# EAGLE design Wiper Control v3 (EAGLE 9.6.1)
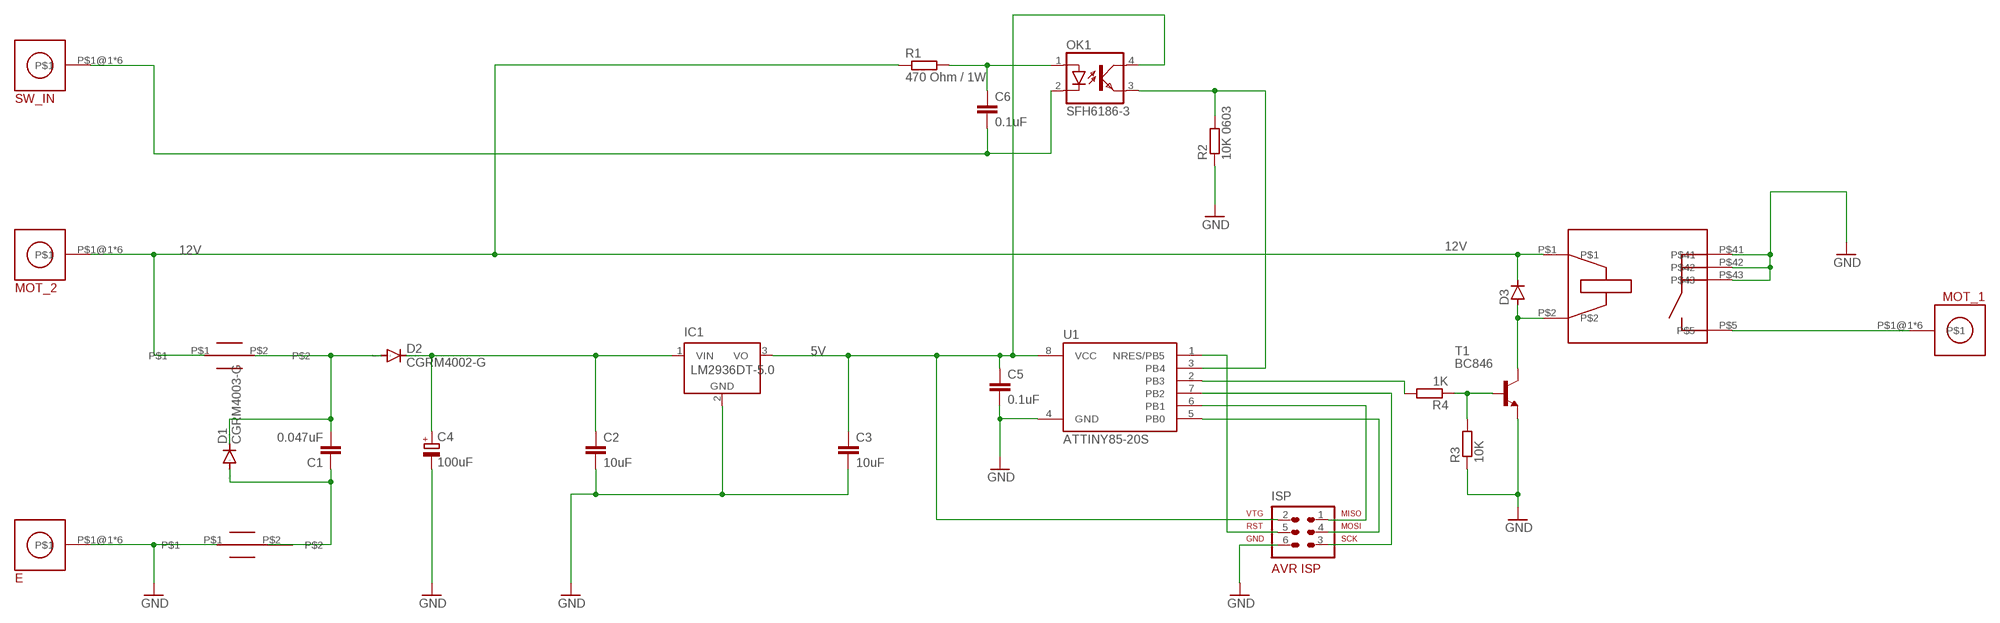
[diagram p0: schematic, sheet 1]

## Parts
B1  FBMJ2125  [FBMJ]
B2  FBMJ2125  [FBMJ]
C1  0.047uF  C-EUC0603  [C0603]
C2  10uF  C-EUC0805  [C0805]
C3  10uF  C-EUC0805  [C0805]
C4  100uF  CPOL-EUE2.5-7  [E2,5-7]
C5  0.1uF  C-EUC0603  [C0603]
C6  0.1uF  C-EUC0603  [C0603]
D1  CGRM4003-G  [SOD-123_MINI-SMA]
D2  CGRM4002-G  [SOD-123_MINI-SMA]
D3  D-SOD123  [SOD123]
E  M4_SCREW_TERMINAL  [M4_SCREW_TERMINAL]
IC1  LM2936DT-5.0  [TO252]
ISP  AVR-ISP-6  [AVR-ISP-6]
MOT_1  M4_SCREW_TERMINAL  [M4_SCREW_TERMINAL]
MOT_2  M4_SCREW_TERMINAL  [M4_SCREW_TERMINAL]
OK1  SFH6186-3  [SMD4-7]
R1  470 Ohm / 1W  R-EU_R2512  [R2512]
R2  10K 0603  R-EU_R0603  [R0603]
R3  10K  R-EU_R0603  [R0603]
R4  1K  R-EU_R0603  [R0603]
SW_IN  M4_SCREW_TERMINAL  [M4_SCREW_TERMINAL]
T1  BC846  [SOT23]
U1  ATTINY85-20S  [SOIC8_EIAJ_208MIL]
U$3  RELAY  [RELAY]

## Nets
5V: C3.1 C5.1 IC1.3(VO) ISP.2 OK1.4(COL) U1.8(VCC)
12V: B1.P$1 D3.1(C) MOT_2.P$1@1 MOT_2.P$1@2 MOT_2.P$1@3 MOT_2.P$1@4 MOT_2.P$1@5 MOT_2.P$1@6 R1.1 U$3.P$1
GND: B2.P$1 C2.2 C3.2 C4.- C5.2 E.P$1@1 E.P$1@2 E.P$1@3 E.P$1@4 E.P$1@5 E.P$1@6 IC1.2(GND) ISP.6 R2.1 R3.1 T1.2(E) U1.4(GND) U$3.P$41 U$3.P$42 U$3.P$43
N$1: B1.P$2 C1.2 D1.C D2.A
N$2: B2.P$2 C1.1 D1.A
N$3: C2.1 C4.+ D2.C IC1.1(VIN)
N$4: ISP.1 U1.6(PB1)
N$5: ISP.4 U1.5(PB0)
N$6: ISP.3 U1.7(PB2)
N$7: ISP.5 U1.1(NRES/PB5)
N$8: D3.2(A) T1.3(C) U$3.P$2
N$9: R3.2 R4.1 T1.1(B)
N$10: MOT_1.P$1@1 MOT_1.P$1@2 MOT_1.P$1@3 MOT_1.P$1@4 MOT_1.P$1@5 MOT_1.P$1@6 U$3.P$5
N$11: C6.1 OK1.1(A) R1.2
N$13: OK1.3(EMIT) R2.2 U1.3(PB4)
N$14: R4.2 U1.2(PB3)
N$20: C6.2 OK1.2(C) SW_IN.P$1@1 SW_IN.P$1@2 SW_IN.P$1@3 SW_IN.P$1@4 SW_IN.P$1@5 SW_IN.P$1@6

## Library data of the parts
B1 B2 = Automotive 12V5V Converter:FBMJ2125
C1-C3 C5 C6 = rcl:C-EU: CAPACITOR, European symbol; SPICEPREFIX: C
C4 = rcl:CPOL-EU: POLARIZED CAPACITOR, European symbol; SPICEPREFIX: C
D1 D2 = diode:CGRM400*-G: Molded plasitc,JEDEC SOD-123/Mini SMA Source: Comchip CGRM4001-G.pdf
D3 = semicon-smd-ipc:D-: DIODE unfilled
E MOT_1 MOT_2 SW_IN = Automotive 12V5V Converter:M4_SCREW_TERMINAL
IC1 = national-semiconductor:LM2936?*: Ultra-Low Quiescent Current LDO Voltage Regulator Source: Data sheet <http://www.national.com/ds/LM/LM2936.pdf>; MF: NATIONAL SEMICONDUCTOR; MPN: LM2936DT-5.0/NOPB; OC_FARNELL: 1286864; OC_NEWARK: 41K4501
ISP = atmel:AVR-ISP-6: AVR ISP-6 Serial Programming Header
OK1 = optocoupler:SFH618?*: Optocoupler, Phototransistor Output, Low Input Current Source: Data sheet <http://www.vishay.com/docs/83673/sfh618.pdf>; MF: VISHAY/TELEFUNKEN; MPN: SFH6186-3; OC_FARNELL: 1469529; OC_NEWARK: 21H7751
R1-R4 = rcl:R-EU_: RESISTOR, European symbol; SPICEPREFIX: R
T1 = transistor-neu-to92:BC846: NPN TRANSISTOR
U1 = _hhn_attiny25_45_85:ATTINY85*: ATMEL ATtiny 85 Packages: P = PDIP 08 30mil S = SOIC 08 EIAJ 208mil Technologies Note: for complete ordering code (temp. range, finish, tape&reel etc.) see www.atmel.com • Supply Voltage: V = (1.8…5.5)V | [blank] = (2.7…5.5)V • Speed: 10 = 10 MHz | 20 = 20 MHz Author: Dipl.-Ing. FH Rainer Bayer HHN Hochschule Heilbronn (Heilbronn University), rainer.bayer@hs-heilbronn.de Ingenieurbüro ing-rb, mail@ing-rb.de
U$3 = Automotive 12V5V Converter:RELAY

## Board
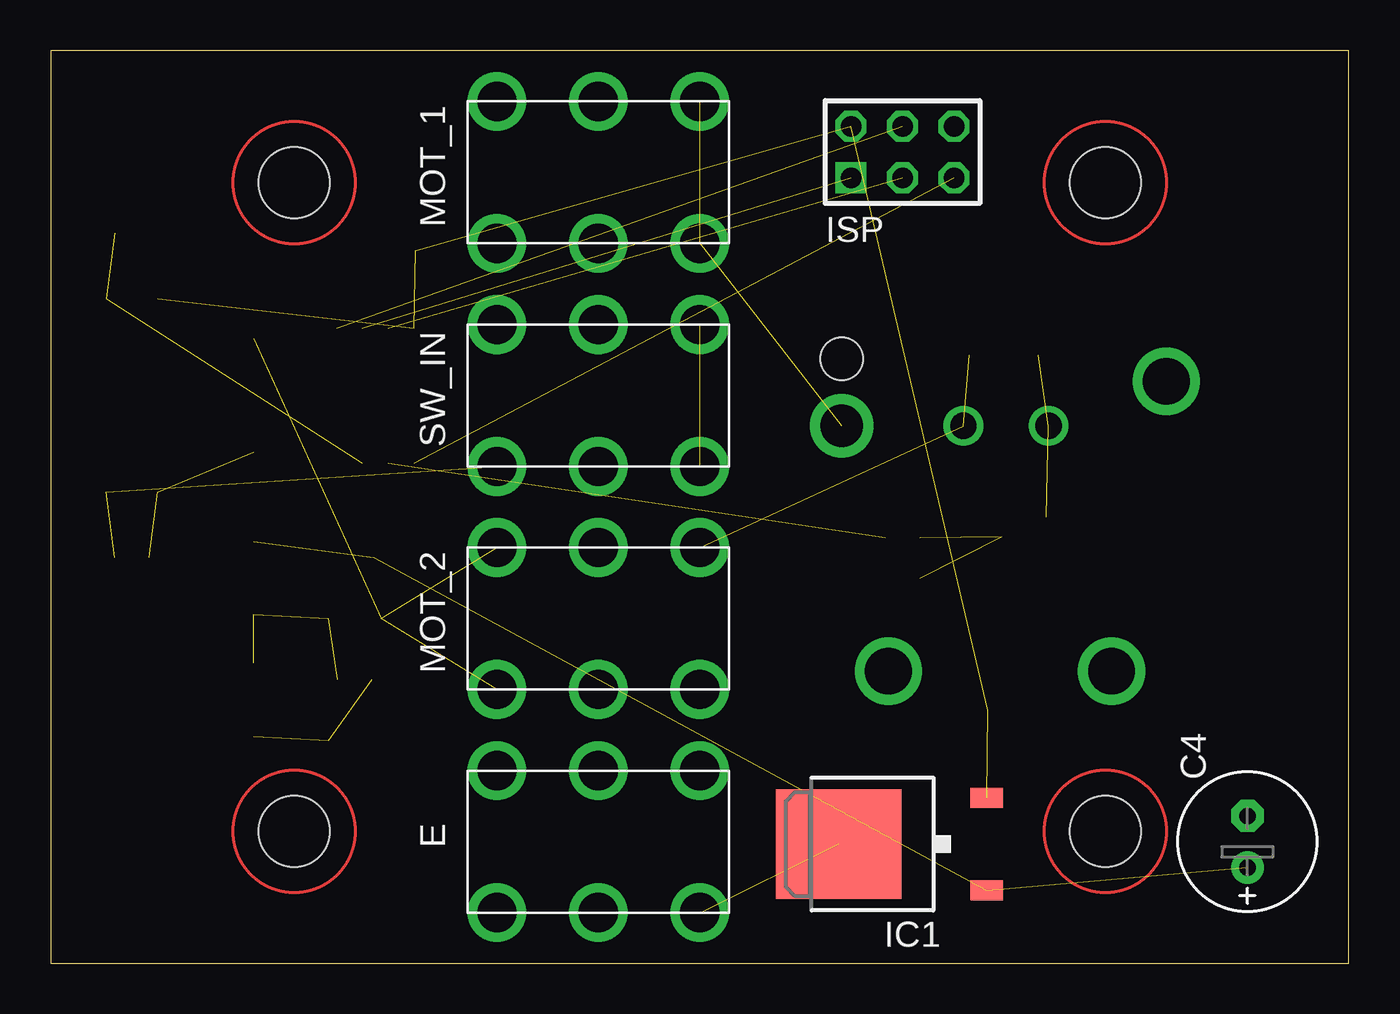
[diagram p1: board, top side]
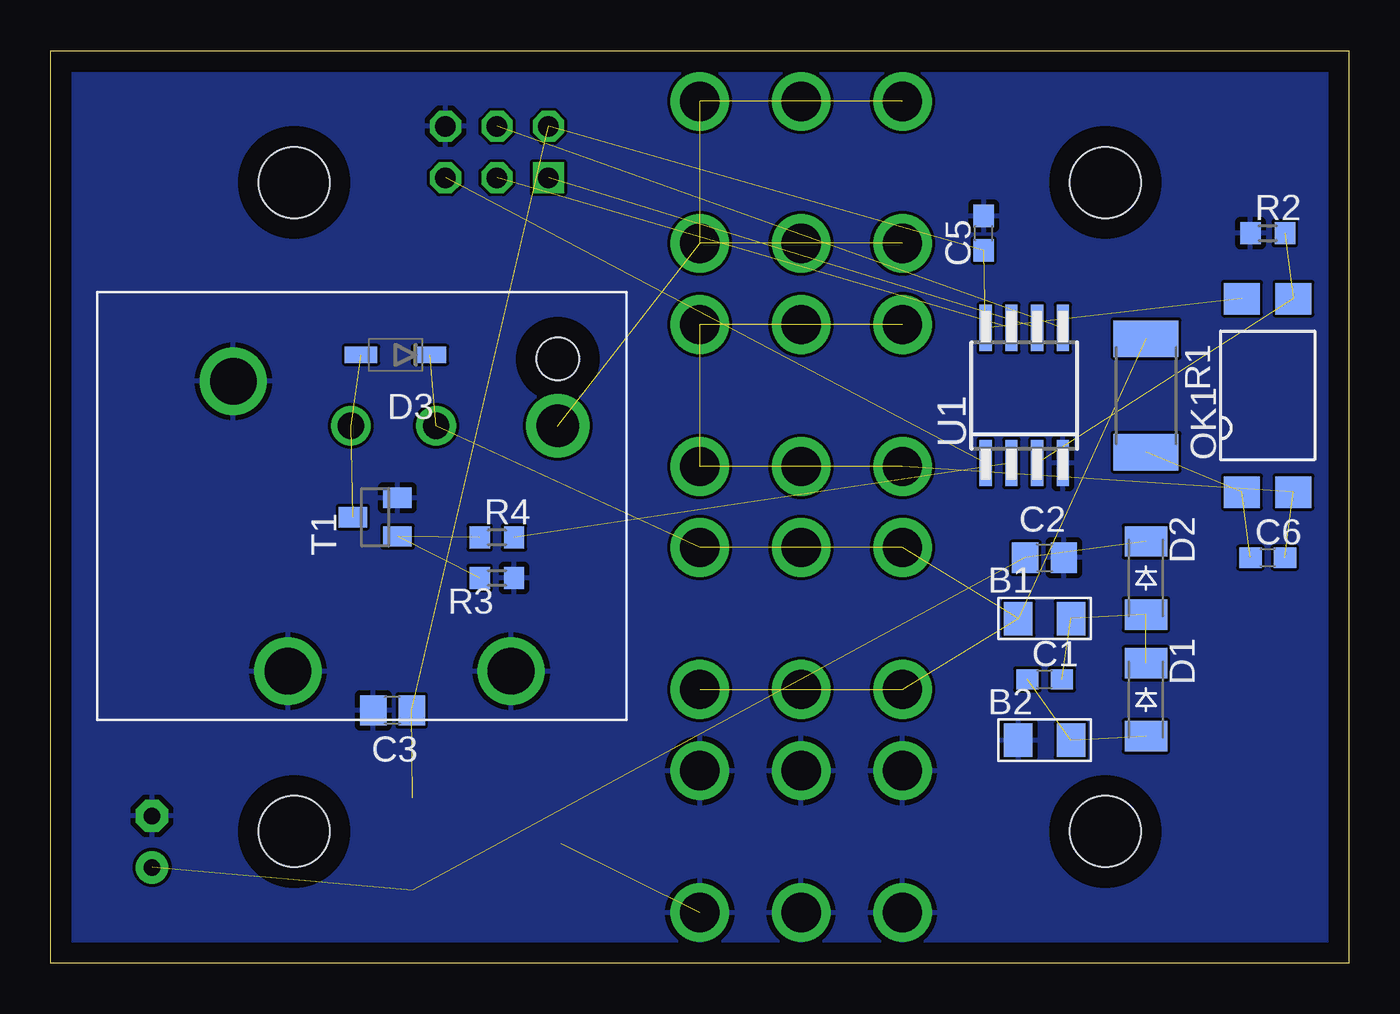
[diagram p2: board, bottom side, seen from below]

Size 64 x 45 mm. Coordinates in mm from the lower left corner, seen from the top.
Outline: 0,0 64,0 64,45 0,45 0,0
Copper layers (1*16): Top 0.035mm / dielectric 1.5mm / Bottom 0.035mm
Design rules "default": minimum track width 6mil, minimum drill 0.35mm, track to track 6mil, track to pad 6mil, pad to pad 6mil, via to via 6mil, smd to smd 6mil, copper to edge 40mil, drill to drill 6mil, minimum pad ring 10mil, minimum via ring 8mil, stop-mask expansion 4mil, vias tented up to drill 0mil, thermal gap 10mil
Holes 3.5 mm at 12,6.5 12,38.5 52,6.5 52,38.5

### Footprints (pad centres in the part's own frame; a part is rotated, then mirrored left to right if it is on the bottom)
FBMJ = smd 1.4 x 1.65: P$1 -1.3,0; P$2 1.3,0
C0603 = smd 1.1 x 1: 1 -0.85,0; 2 0.85,0
C0805 = smd 1.3 x 1.5: 1 -0.95,0; 2 0.95,0
E2,5-7 = drill 0.813 pad 1.6: + -1.27,0 | drill 0.813 pad 1.6 octagon: - 1.27,0
SOD-123_MINI-SMA = smd 1.5 x 2.1: A 1.8,0; C -1.8,0
SOD123 = smd 1.6 x 0.8: 1 -1.7,0; 2 1.7,0
M4_SCREW_TERMINAL = drill 1.93: P$1@1 0,0; P$1@2 5,0; P$1@3 10,0; P$1@4 0,7; P$1@5 5,7; P$1@6 10,7
TO252 = smd 1 x 1.6: 1 -2.28,-4.8; 3 2.28,-4.8 | smd 5.4 x 6.2: 2 0,2.5
AVR-ISP-6 = drill 1.016 square: 1 -2.54,-1.27 | drill 1.016 octagon: 2 -2.54,1.27; 3 0,-1.27; 4 0,1.27; 5 2.54,-1.27; 6 2.54,1.27
SMD4-7 = smd 1.78 x 1.55: 1 -1.27,-4.77; 2 1.27,-4.77; 3 1.27,4.77; 4 -1.27,4.77
R2512 = smd 1.8 x 3.2: 1 -2.8,0; 2 2.8,0
R0603 = smd 1 x 1.1: 1 -0.85,0; 2 0.85,0
SOT23 = smd 1 x 1.4: 1 -0.95,-1.1; 2 0.95,-1.1; 3 0,1.1
SOIC8_EIAJ_208MIL = smd 0.6 x 2.286: 1 -1.905,-3.33; 2 -0.635,-3.33; 3 0.635,-3.33; 4 1.905,-3.33; 5 1.905,3.33; 6 0.635,3.33; 7 -0.635,3.33; 8 -1.905,3.33
RELAY = drill 1.3: P$1 6,0; P$2 10.2,0 | drill 2.1: P$5 0,0 | drill 2.3: P$41 2.3,-12.1; P$42 13.3,-12.1; P$43 16,2.2 | hole 2.1: 0,3.3

### Placement (x,y rotation side)
B1  15,17 0 bottom
B2  15,11 0 bottom
C1  15,14 0 bottom
C2  15,20 0 bottom
C3  47.15,12.47 180 bottom
C4  59,6 90 top
C5  18,36 90 bottom
C6  4,20 0 bottom
D1  10,13 270 bottom
D2  10,19 270 bottom
D3  47,30 180 bottom
E  22,2.5 0 top
IC1  41.35,5.88 90 top
ISP  42,40 0 top
MOT_1  22,35.5 0 top
MOT_2  22,13.5 0 top
OK1  4,28 0 bottom
R1  10,28 270 bottom
R2  4,36 0 bottom
R3  42,19 180 bottom
R4  42,21 0 bottom
SW_IN  22,24.5 0 top
T1  48,22 90 bottom
U1  16,28 0 bottom
U$3  39,26.5 0 top

### Tracks (layer width: path | path; a pad name or v marks a point on that pad's centre or on a via)
5V  (5 unrouted)
12V  (9 unrouted)
GND  (1 unrouted)
  pour Bottom: 1,44 1,1 63,1 63,44
N$1  (3 unrouted)
N$2  (2 unrouted)
N$3  (3 unrouted)
N$4  (1 unrouted)
N$5  (1 unrouted)
N$6  (1 unrouted)
N$7  (1 unrouted)
N$8  (2 unrouted)
N$9  (2 unrouted)
N$10  (6 unrouted)
N$11  (2 unrouted)
N$13  (2 unrouted)
N$14  (1 unrouted)
N$20  (7 unrouted)
(copper drawn outside any net)
  shapes: Top circle x4